# EAGLE design ASD2101 (EAGLE 6.3)
DATABASE: ./../../../../../Components/TinyCircuits_Part_Database.txt
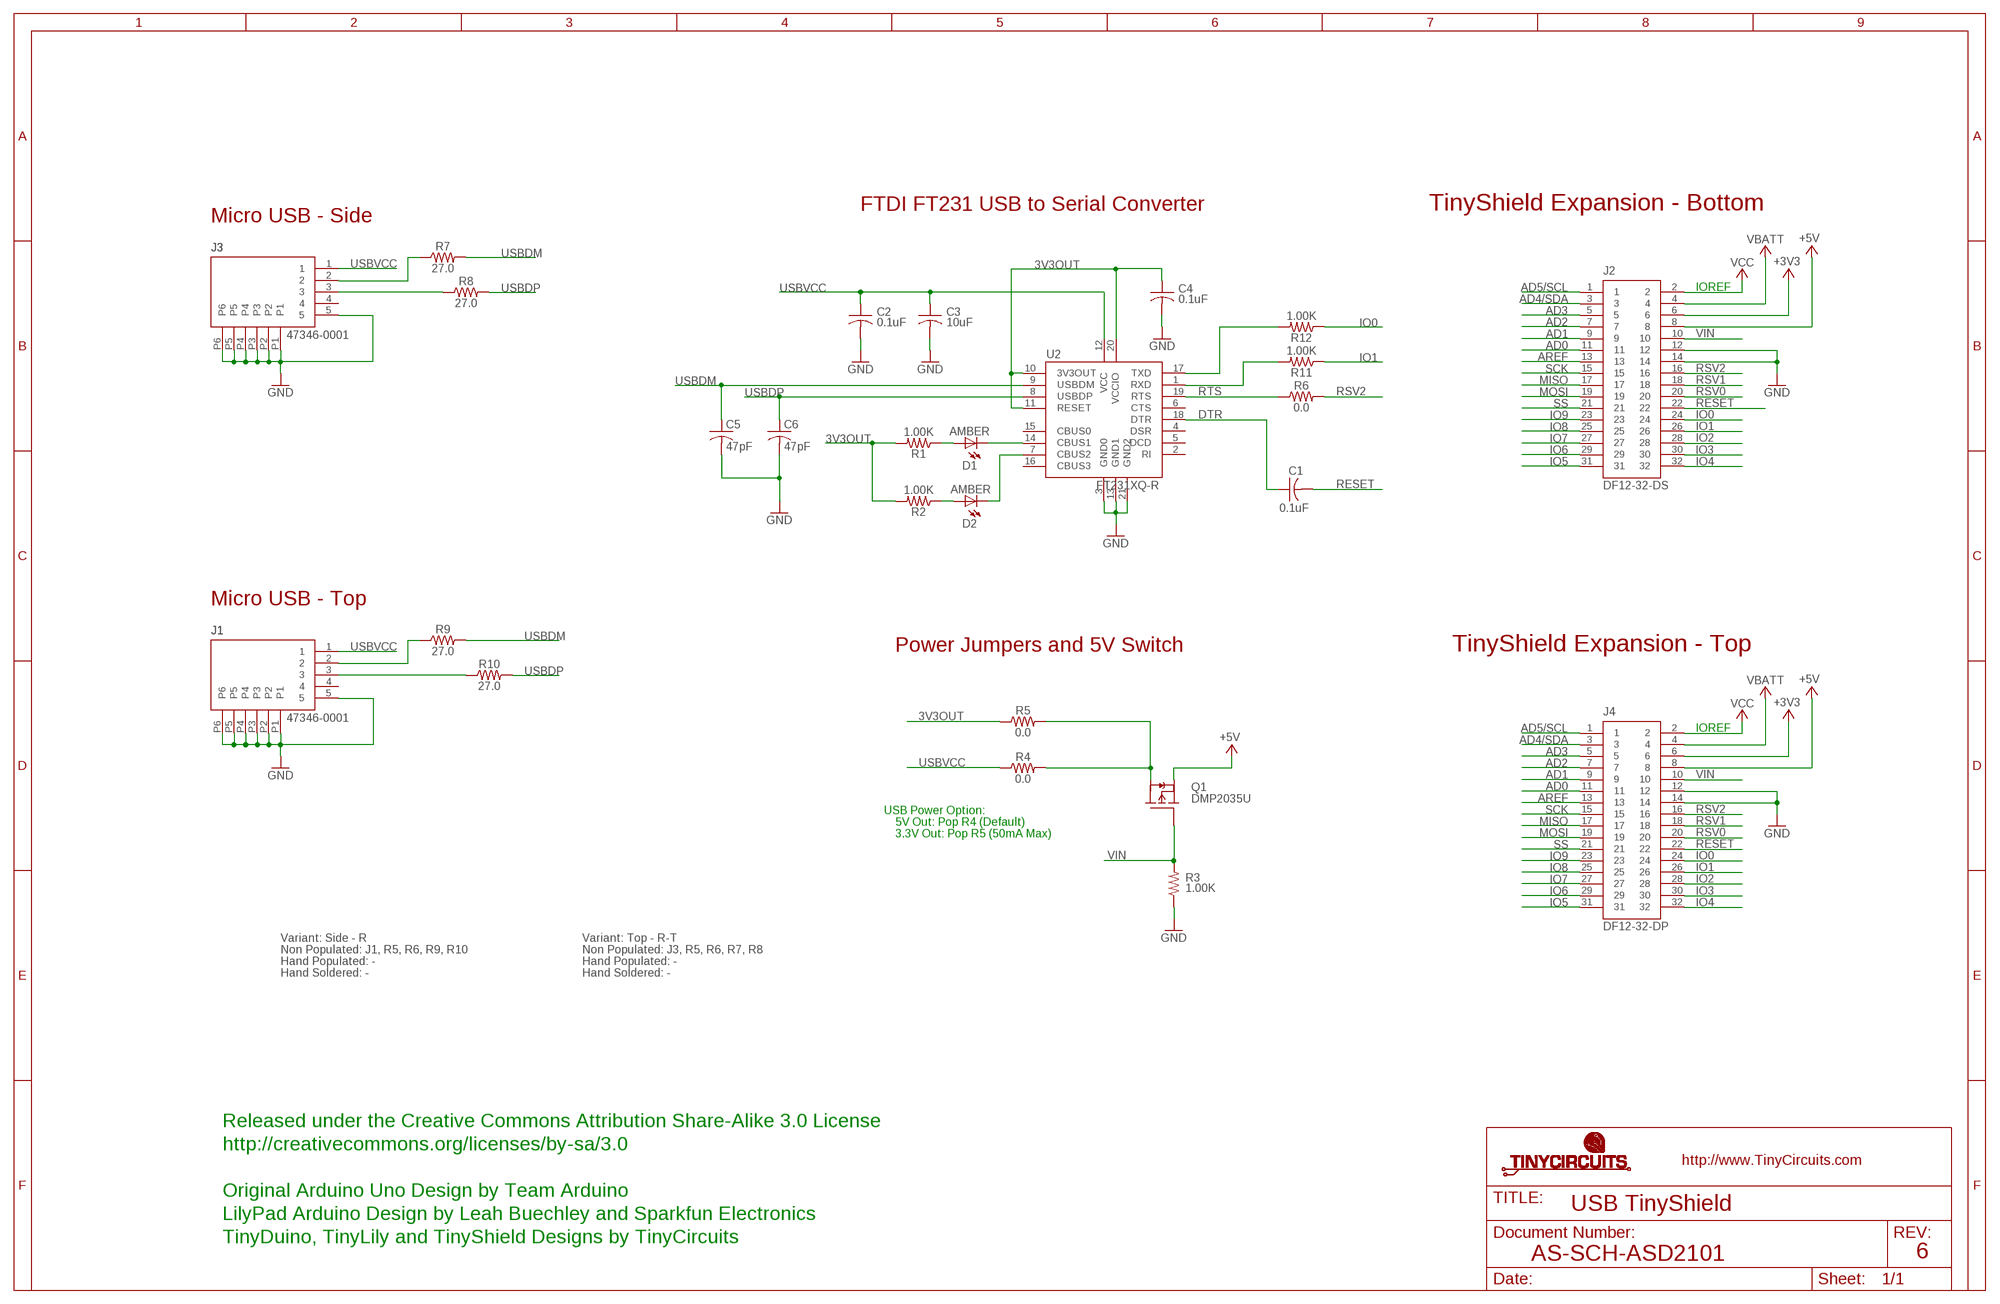
[diagram p0: schematic, sheet 1]

## Parts
C1  0.1uF  AS-ITM-00008  [C0402]
C2  0.1uF  AS-ITM-00008  [C0402]
C3  10uF  AS-ITM-00002  [C0603]
C4  0.1uF  AS-ITM-00008  [C0402]
C5  47pF  AS-ITM-00241  [0402]
C6  47pF  AS-ITM-00241  [0402]
D1  AMBER  AS-ITM-00026  [LNJ_LED]
D2  AMBER  AS-ITM-00026  [LNJ_LED]
J1  47346-0001  AS-ITM-00021  [MICRO_USB]
J2  DF12-32-DS  AS-ITM-00012  [DF12-32-DS]
J3  47346-0001  AS-ITM-00021  [MICRO_USB]
J4  DF12-32-DP  AS-ITM-00015  [DF12-32-DP]
Q1  DMP2035U  AS-ITM-00024  [SOT23]
R1  1.00K  AS-ITM-00003  [0402]
R2  1.00K  AS-ITM-00003  [0402]
R3  1.00K  AS-ITM-00003  [0402]
R4  0.0  AS-ITM-00076  [0402]
R5  0.0  AS-ITM-00076  [0402]
R6  0.0  AS-ITM-000760402_SHORT  [0402_SHORT]
R7  27.0  AS-ITM-00240  [0402]
R8  27.0  AS-ITM-00240  [0402]
R9  27.0  AS-ITM-00240  [0402]
R10  27.0  AS-ITM-00240  [0402]
R11  1.00K  AS-ITM-00003  [0402]
R12  1.00K  AS-ITM-00003  [0402]
U2  FT231XQ-R  AS-ITM-00223  [QFN20]

## Nets
3V3OUT: C4.1 R1.2 R2.2 R5.1 U2.10(3V3OUT) U2.11(RESET) U2.20(VCCIO)
+3V3: J2.6 J4.6
+5V: J2.8 J4.8 Q1.E(S)
AD0: J2.11 J4.11
AD1: J2.9 J4.9
AD2: J2.7 J4.7
AD3: J2.5 J4.5
AD4/SDA: J2.3 J4.3
AD5/SCL: J2.1 J4.1
AREF: J2.13 J4.13
DTR: C1.1 U2.18(DTR)
GND: C2.2 C3.2 C4.2 C5.2 C6.2 J1.5 J1.P1 J1.P2 J1.P3 J1.P4 J1.P5 J1.P6 J2.12 J2.14 J3.5 J3.P1 J3.P2 J3.P3 J3.P4 J3.P5 J3.P6 J4.12 J4.14 R3.1 U2.3(GND0) U2.13(GND1) U2.21(GND2)
IO0: J2.24 J4.24 R12.1
IO1: J2.26 J4.26 R11.1
IO2: J2.28 J4.28
IO3: J2.30 J4.30
IO4: J2.32 J4.32
IO5: J2.31 J4.31
IO6: J2.29 J4.29
IO7: J2.27 J4.27
IO8: J2.25 J4.25
IO9: J2.23 J4.23
MISO: J2.17 J4.17
MOSI: J2.19 J4.19
N$1: J3.2 R7.1
N$2: J1.2 R9.1
N$3: J1.3 R10.1
N$4: Q1.C(D) R4.2 R5.2
N$5: D2.C U2.7(CBUS2)
N$6: D1.A R1.1
N$7: D2.A R2.1
N$8: J3.3 R8.1
N$9: R11.2 U2.1(RXD)
N$10: R12.2 U2.17(TXD)
N$16: D1.C U2.14(CBUS1)
RESET: C1.2 J2.22 J4.22
RSV0: J2.20 J4.20
RSV1: J2.18 J4.18
RSV2: J2.16 J4.16 R6.2
RTS: R6.1 U2.19(RTS)
SCK: J2.15 J4.15
SS: J2.21 J4.21
USBDM: C5.1 R7.2 R9.2 U2.9(USBDM)
USBDP: C6.1 R8.2 R10.2 U2.8(USBDP)
USBVCC: C2.1 C3.1 J1.1 J3.1 R4.1 U2.12(VCC)
VBATT: J2.4 J4.4
VCC: J2.2 J4.2
VIN: J2.10 J4.10 Q1.B(G) R3.2
Unconnected: J1.4 J3.4 U2.2(RI) U2.4(DSR) U2.5(DCD) U2.6(CTS) U2.15(CBUS0) U2.16(CBUS3)

## Notes on the sheet
- FTDI FT231 USB to Serial Converter | TinyShield Expansion - Bottom
- Micro USB - Side
- IOREF
- Micro USB - Top
- Power Jumpers and 5V Switch | TinyShield Expansion - Top
- IOREF
- USB Power Option:
- 5V Out: Pop R4 (Default)
- 3.3V Out: Pop R5 (50mA Max)
- Variant: Side - R | Variant: Top - R-T
- Non Populated: J1, R5, R6, R9, R10 | Non Populated: J3, R5, R6, R7, R8
- Hand Populated: - | Hand Populated: -
- Hand Soldered: - | Hand Soldered: -
- Released under the Creative Commons Attribution Share-Alike 3.0 License
- http://creativecommons.org/licenses/by-sa/3.0
- Original Arduino Uno Design by Team Arduino
- USB TinyShield
- LilyPad Arduino Design by Leah Buechley and Sparkfun Electronics
- TinyDuino, TinyLily and TinyShield Designs by TinyCircuits
- AS-SCH-ASD2101 | 6

## Library data of the parts
C1 C2 C4 = tinycircuits:AS-ITM-00008: CAP CER 0.1UF 16V 10% X5R 0402; PARTNO: AS-ITM-00008
C3 = tinycircuits:AS-ITM-00002: CAP CER 10UF 10V 20% X5R 0603; PARTNO: AS-ITM-00002
C5 C6 = tinycircuits:AS-ITM-00241: CAP CER 47PF 50V 5% NP0 0402; PARTNO: AS-ITM-00241
D1 D2 = tinycircuits:AS-ITM-00026: LED AMBER SIDE VIEW SMD; PARTNO: AS-ITM-00026; PNPROTATION: 90
J1 J3 = tinycircuits:AS-ITM-00021: CONN RCPT 5POS MICRO USB R/A; PARTNO: AS-ITM-00021; PNPROTATION: 90
J2 = tinycircuits:AS-ITM-00012: CONN RECEPT 32POS 3MM SMD 0.5MM; PARTNO: AS-ITM-00012
J4 = tinycircuits:AS-ITM-00015: CONN HEADER 32POS 3MM SMD 0.5MM; PARTNO: AS-ITM-00015
Q1 = tinycircuits:AS-ITM-00024: P-Channel MOSFET SOT-23; PARTNO: AS-ITM-00024; PNPROTATION: 0
R1-R3 R11 R12 = tinycircuits:AS-ITM-00003: RES 1.00K OHM 1/16W 1% 0402; PARTNO: AS-ITM-00003
R4 R5 = tinycircuits:AS-ITM-00076: RES 0.0 OHM 1/16W 1% 0402 SMD; PARTNO: AS-ITM-00076
R6 = tinycircuits:AS-ITM-00076: RES 0.0 OHM 1/16W 1% 0402 SMD; VALUE: SHORT
R7-R10 = tinycircuits:AS-ITM-00240: RES 27 OHM 1/16W 5% 0402 SMD; PARTNO: AS-ITM-00240
U2 = tinycircuits:AS-ITM-00223: IC USB SERIAL FULL UART 20QFN; PARTNO: AS-ITM-00223; PNPROTATION: 270

## Net classes
2 gnd: width 0.305 mm, drill 0.559 mm, clearance 0.254 mm

## Board
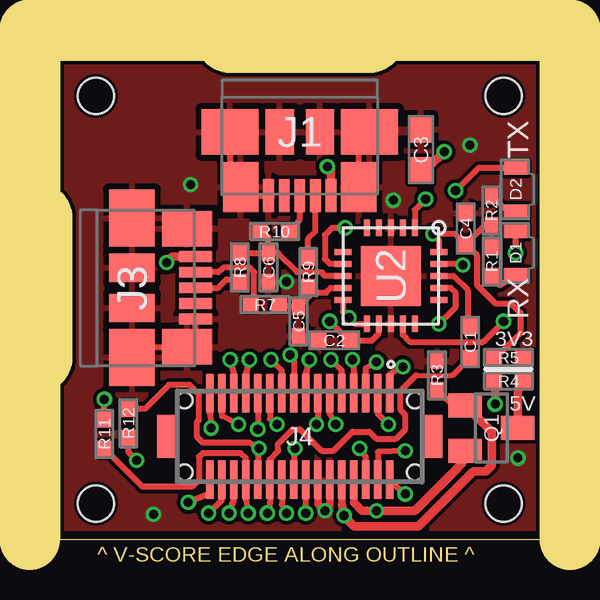
[diagram p1: board, top side]
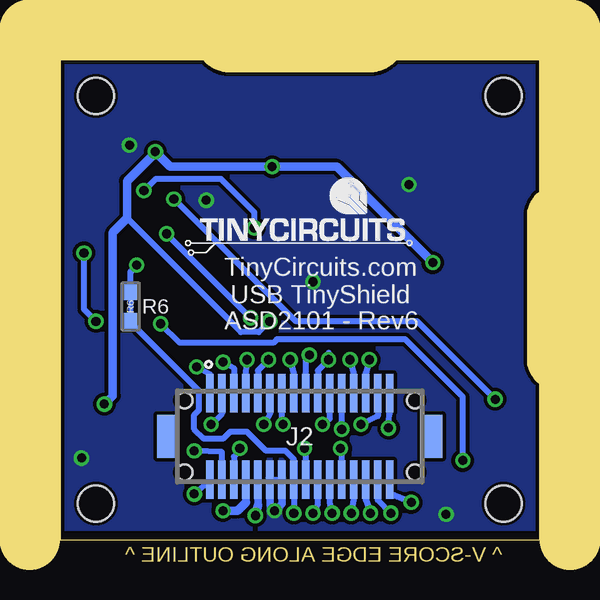
[diagram p2: board, bottom side, seen from below]

Size 20 x 20 mm. Coordinates in mm from the lower left corner, seen from the top.
Outline: 20,20 20,0 0,0 0,6.5 arc45 0.5,7.4 0.5,13.6 arc45 0,14.5 0,20 6,20 arc45 6.9,19.5 13.1,19.5 arc45 14,20 20,20
Copper layers (1*16): Top 0.035mm / dielectric 1.5mm / Bottom 0.035mm
Design rules "default *": minimum track width 8mil, minimum drill 15mil, track to track 6mil, track to pad 6mil, pad to pad 6mil, via to via 6mil, smd to smd 6mil, copper to edge 6mil, drill to drill 8mil, minimum pad ring 8mil, minimum via ring 5mil, stop-mask expansion 4mil, vias tented up to drill 25mil, thermal gap 10mil
Holes 1.5 mm at 1.5,18.5 18.5,18.5 18.5,1.5 1.5,1.5
tRestrict: 1 lines
bRestrict: 1 lines
Milling: 5 lines

### Footprints (pad centres in the part's own frame; a part is rotated, then mirrored left to right if it is on the bottom)
C0402 = smd 0.65 x 0.6: 1 -0.65,0; 2 0.65,0
C0603 = smd 1.1 x 1: 1 -0.85,0; 2 0.85,0
0402 = smd 0.65 x 0.55: 1 -0.6,0; 2 0.6,0
LNJ_LED = smd 1 x 0.55: A 0,0.9; C 0,-0.9
MICRO_USB = smd 1.38 x 0.45: 1 2.66,1.3; 2 2.66,0.65; 3 2.66,0; 4 2.66,-0.65; 5 2.66,-1.3 | smd 2.1 x 1.475: P1 2.3,-2.462; P2 2.3,2.462 | smd 1.9 x 2.375: P3 0,2.913; P4 0,-2.913 | smd 1.9 x 1.175: P5 0,0.838; P6 0,-0.838
DF12-32-DS = smd 0.3 x 1.6: 1 -3.75,1.8; 2 -3.75,-1.8; 3 -3.25,1.8; 4 -3.25,-1.8; 5 -2.75,1.8; 6 -2.75,-1.8; 7 -2.25,1.8; 8 -2.25,-1.8; 9 -1.75,1.8; 10 -1.75,-1.8; 11 -1.25,1.8; 12 -1.25,-1.8; 13 -0.75,1.8; 14 -0.75,-1.8; 15 -0.25,1.8; 16 -0.25,-1.8; 17 0.25,1.8; 18 0.25,-1.8; 19 0.75,1.8; 20 0.75,-1.8; 21 1.25,1.8; 22 1.25,-1.8; 23 1.75,1.8; 24 1.75,-1.8; 25 2.25,1.8; 26 2.25,-1.8; 27 2.75,1.8; 28 2.75,-1.8; 29 3.25,1.8; 30 3.25,-1.8; 31 3.75,1.8; 32 3.75,-1.8 | smd 0.9 x 1.8: F1 -5.5,0; F2 5.5,0 | hole 0.65: -4.8,1.5; 4.8,1.5
DF12-32-DP = smd 0.3 x 1.6: 1 -3.75,-1.8; 2 -3.75,1.8; 3 -3.25,-1.8; 4 -3.25,1.8; 5 -2.75,-1.8; 6 -2.75,1.8; 7 -2.25,-1.8; 8 -2.25,1.8; 9 -1.75,-1.8; 10 -1.75,1.8; 11 -1.25,-1.8; 12 -1.25,1.8; 13 -0.75,-1.8; 14 -0.75,1.8; 15 -0.25,-1.8; 16 -0.25,1.8; 17 0.25,-1.8; 18 0.25,1.8; 19 0.75,-1.8; 20 0.75,1.8; 21 1.25,-1.8; 22 1.25,1.8; 23 1.75,-1.8; 24 1.75,1.8; 25 2.25,-1.8; 26 2.25,1.8; 27 2.75,-1.8; 28 2.75,1.8; 29 3.25,-1.8; 30 3.25,1.8; 31 3.75,-1.8; 32 3.75,1.8 | smd 0.9 x 1.8: F1 -5.5,0; F2 5.5,0 | hole 0.65: -4.8,1.5; 4.8,1.5
SOT23 = smd 1 x 1.4: B -0.95,-1.1; C 0,1.1; E 0.95,-1.1
0402_SHORT = smd 0.65 x 0.55: 1 -0.6,0; 2 0.6,0
QFN20 = smd 0.7 x 0.25: 1 -2,1; 2 -2,0.5; 3 -2,0; 4 -2,-0.5; 5 -2,-1; 11 2,-1; 12 2,-0.5; 13 2,0; 14 2,0.5; 15 2,1 | smd 0.25 x 0.7: 6 -1,-2; 7 -0.5,-2; 8 0,-2; 9 0.5,-2; 10 1,-2; 16 1,2; 17 0.5,2; 18 0,2; 19 -0.5,2; 20 -1,2 | smd 2.5 x 2.5: 21 0,0

### Placement (x,y rotation side)
C1  17.1,8.24 270 top
C2  11.44,8.31 180 top
C3  15.05,16.26 90 top
C4  16.92,12.97 90 top
C5  9.95,9.1 270 top
C6  8.7,11.35 270 top
D1  19,11.95 180 top
D2  19,14.6 180 top
J1  10,17 270 top
J2  10,4.3 0 bottom
J3  3,10.5 0 top
J4  10,4.3 180 top
Q1  17.99,4.65 270 top
R1  18,11.6 90 top
R2  17.99,13.72 270 top
R3  15.72,6.85 270 top
R4  18.7,6.61 0 top
R5  18.7,7.59 0 top
R6  17.06,9.71 270 bottom
R7  8.55,9.8 0 top
R8  7.5,11.35 90 top
R9  10.35,11.15 270 top
R10  8.95,12.85 180 top
R11  1.85,4.4 90 top
R12  2.85,4.85 270 top
U2  13.8,11 270 top
U$1  [DOCFIELD-TINYCIRCUITS-PCB]  33.97,-10.03 0 top  (outside the outline)

### Tracks (layer width: path | path; a pad name or v marks a point on that pad's centre or on a via)
3V3OUT  (via drill 0.38)
  Top 0.254: U2.11 12.3,9 v12.05,9.25 11.8,9.5 U2.10 | U2.20 15.8,12.5 v15.55,12.75 16.49,12.75 C4.1 | R2.2 17.72,13.12 C4.1 | 18.01,13 R2.2 | R5.1 18.14,7.55 19.2,8.6 19.2,9.45 18.8,9.85 18.15,9.85 17.4,10.6 17.4,11.84 C4.1 | R1.2 18,13.11 R2.2
  Bottom 0.254: v12.05,9.25 v15.55,12.75
+3V3  (via drill 0.38)
  Top 0.254: J2.6 12.75,3.45 v12.5,3.8
  Bottom 0.254: v12.5,3.8 12.75,3.45 J2.6
+5V  (via drill 0.38)
  Top 0.254: Q1.E 16.79,3.2
  Top 0.305: 12.25,1.55 J2.8
  Top 0.356: 12.25,1.55 12.6,1.2 v13.2,1.2 14.8,1.2 16.4,2.8 16.79,3.2
  Bottom 0.305: J2.8 12.25,1.55
  Bottom 0.356: 12.25,1.55 12.6,1.2 v13.2,1.2
AD0  (via drill 0.38)
  Top 0.254: v11.5,4.8 11.25,5.25 J2.11
  Bottom 0.254: J2.11 11.25,5.25 v11.5,4.8
AD1  (via drill 0.38)
  Top 0.254: J2.9 11.75,7.05 v11.3,7.5
  Bottom 0.254: v11.3,7.5 11.75,7.05 J2.9
AD2  (via drill 0.38)
  Top 0.254: v12.2,7.5 12.25,6.95 J2.7
  Bottom 0.254: J2.7 12.25,6.95 v12.2,7.5
AD3  (via drill 0.38)
  Top 0.254: J2.5 12.75,7.15 v13.2,7.4
  Bottom 0.254: v13.2,7.4 12.75,7.15 J2.5
AD4/SDA  (via drill 0.38)
  Top 0.254: v13.7,4.8 13.25,5.25 J2.3
  Bottom 0.254: J2.3 13.25,5.25 v13.7,4.8
AD5/SCL  (via drill 0.38)
  Top 0.254: J2.1 13.75,6.9 v14.3,7.2
  Bottom 0.254: v14.3,7.2 13.75,6.9 J2.1
AREF  (via drill 0.38)
  Top 0.254: J2.13 10.75,5.15 v10.7,4.8
  Bottom 0.254: v10.7,4.8 10.75,5.15 J2.13
DTR
  Top 0.254: U2.18 16.4,11 17,10.4 17,8.94 C1.1
GND  (via drill 0.38)
  Top 0.254: J3.P4 3.45,8.04 J3.P1 5.66,8.3 J3.5 | C2.2 10.14,8.31 C5.2 | J1.P4 7.09,15.15 J1.P1 7.9,14.34 J1.5 | J1.P2 12.46,16.55 J1.P3
  Top 0.305: J4.14 10.75,1.5 v11.05,1.2 | J4.12 11.25,1.45
  Bottom 0.254: J4.14 J4.12 11.25,2.4
  Bottom 0.305: v11.05,1.2 10.75,1.5 J4.14 | 11.25,1.45 11.25,2.4
  other vias: 19.1,3.4 17.1,16.45 9.45,10.75 13.9,14.15 3.9,1.05 5.45,14.8
  pour Top: 0,20 20,20 20,0 0,0
  pour Bottom: 0,20 20,20 20,0 0,0
IO0  (via drill 0.38)
  Top 0.254: J2.24 8.25,3.65 v8.3,3.8 7.9,4.05 5.95,4.05 5.7,4.3 5.7,4.9 5.8,5 5.8,6.05 5.4,6.45 4.55,6.45 3.55,5.45 R12.1
  Bottom 0.254: J2.24 8.25,3.65 v8.3,3.8
IO1  (via drill 0.38)
  Top 0.254: v7.85,1.1 7.75,1.65 J2.26 7.75,3.4 7.55,3.6 5.95,3.6 5.8,3.45 5.8,2.5 5.5,2.2 3.45,2.2 R11.1
  Bottom 0.254: v7.85,1.1 7.75,1.65 J2.26
IO2  (via drill 0.38)
  Top 0.254: v7.05,1.1 7.25,1.65 J2.28
  Bottom 0.254: J2.28 7.25,1.65 v7.05,1.1
IO3  (via drill 0.38)
  Top 0.254: v6.2,1.1 6.75,1.65 J2.30
  Bottom 0.254: J2.30 6.75,1.65 v6.2,1.1
IO4  (via drill 0.38)
  Top 0.254: J2.32 6.25,1.9 v5.35,1.55
  Bottom 0.254: v5.35,1.55 6.25,1.9 J2.32
IO5  (via drill 0.38)
  Top 0.254: J2.31 6.25,5.25 v6.3,4.65
  Bottom 0.254: v6.3,4.65 6.25,5.25 J2.31
IO6  (via drill 0.38)
  Top 0.254: v7.45,4.8 6.75,5.15 J2.29
  Bottom 0.254: J2.29 6.75,5.15 v7.45,4.8
IO7  (via drill 0.38)
  Top 0.254: J2.27 7.25,6.95 v7.1,7.5
  Bottom 0.254: v7.1,7.5 7.25,6.95 J2.27
IO8  (via drill 0.38)
  Top 0.254: v7.9,7.5 7.75,6.95 J2.25
  Bottom 0.254: J2.25 7.75,6.95 v7.9,7.5
IO9  (via drill 0.38)
  Top 0.254: J2.23 v8.25,4.6
  Bottom 0.254: v8.25,4.6 J2.23
MISO  (via drill 0.38)
  Top 0.254: v9.6,7.7 9.75,7.45 J2.17
  Bottom 0.254: J2.17 9.75,7.45 v9.6,7.7
MOSI  (via drill 0.38)
  Top 0.254: J2.19 9.25,7.05 v8.8,7.5
  Bottom 0.254: J2.19 9.25,7.05 v8.8,7.5 8.8,7.8
N$1
  Top 0.229: 7.9,11.35 7.1,11.35
  Top 0.254: J3.2 6.6,11.15 6.85,11.35 7.1,11.35 | R7.1 8.1,10 8.1,11.15 7.9,11.35
N$2
  Top 0.254: R9.1 10.35,12.55 10.65,12.85 J1.2
N$3
  Top 0.254: R10.1 10,13.35 J1.3
N$4
  Top 0.254: R4.2 19.32,6.68 R5.2
  Top 0.356: Q1.C 19.1,6.13 R4.2
N$5  (via drill 0.38)
  Top 0.254: U2.7 11.25,11.5 11.05,11.7 11.05,12.7 11.35,13 v11.9,13 | D2.C 17.45,15.5 v16.5,14.55
  Bottom 0.254: v16.5,14.55 16,15.05 13.3,15.05 11.9,13.65 v11.9,13
N$6
  Top 0.254: R1.1 18.35,10.6 D1.A
N$7
  Top 0.254: R2.1 18.63,13.72 D2.A
N$8
  Top 0.254: J3.3 6.6,10.5 6.95,10.85 7.45,10.85 R8.1
N$9  (via drill 0.38)
  Top 0.254: R11.2 v1.85,5.85 | v15.25,14.2 14.8,13.75 U2.1
  Bottom 0.254: v1.85,5.85 5.1,9.1 10.15,9.1 v15.25,14.2
N$10  (via drill 0.38)
  Top 0.254: R12.2 2.85,3.65 v3.2,3.3 | v15.8,9 16.5,9.7 16.5,10.3 16.3,10.5 U2.17
  Bottom 0.254: v3.2,3.3 3.2,5.95 5.6,8.35 10.95,8.35 11.1,8.2 15,8.2 v15.8,9
N$16  (via drill 0.38)
  Top 0.254: U2.14 14.3,8.55 14.6,8.25 17.65,8.25 v18.5,9.1 | v19,11.95 D1.C
  Bottom 0.254: v18.5,9.1 19,9.6 v19,11.95
RESET  (via drill 0.38)
  Top 0.203: 14.85,6.85 16.36,6.85
  Top 0.254: v8.65,1.1 8.75,1.55 J2.22 8.75,3.35 9.1,3.7 9.1,4 9.7,4.6 10,4.6 10.9,3.7 11.4,3.7 12.2,4.5 12.9,4.5 13.2,4.2 14,4.2 14.4,4.6 14.4,5.2 14.2,5.4 14.2,6.2 14.85,6.85 | 16.36,6.85 C1.2
  Bottom 0.254: v8.65,1.1 8.75,1.55 J2.22
RSV0  (via drill 0.38)
  Top 0.254: J2.20 9.25,1.45 v9.45,1.1
  Bottom 0.254: v9.45,1.1 9.25,1.45 J2.20
RSV1  (via drill 0.38)
  Top 0.254: v9.8,3.8 9.75,3.75 J2.18
  Bottom 0.254: J2.18 9.75,3.75 v9.8,3.8
RSV2  (via drill 0.38)
  Top 0.254: v10.25,1.1 J2.16
  Bottom 0.254: v10.25,1.1 J2.16 10.25,3.35 10.6,3.7 11.4,3.7 12.2,4.5 12.9,4.5 13.2,4.2 14,4.2 14.4,4.6 14.4,5.2 14.2,5.4 14.2,6.2 14.6,6.6 | 14.6,6.6 14.59,6.6 | 14.6,6.6 17.06,9.06 R6.2
RTS  (via drill 0.38)
  Top 0.254: v16.8,11.45 16.75,11.5 U2.19
  Bottom 0.254: R6.1 17.06,11.16 v16.8,11.45
SCK  (via drill 0.38)
  Top 0.254: v10.4,7.5 10.25,6.95 J2.15
  Bottom 0.254: J2.15 10.25,6.95 v10.4,7.5
SS  (via drill 0.38)
  Top 0.254: J2.21 8.75,5.05 v9.05,4.8
  Bottom 0.254: v9.05,4.8 8.75,5.05 J2.21
USBDM
  Top 0.254: 10.55,10.3 C5.1 9.05,9.75 R7.2 | 10.55,10.3 R9.2 | 10.55,10.3 11.1,10.3 11.3,10.5 U2.9
USBDP
  Top 0.229: 10.9,11.15 9.9,11.15
  Top 0.254: R8.2 C6.1 | C6.1 8.7,12.6 R10.2 | U2.8 11.05,11 10.9,11.15 | 9.9,11.15 9.1,11.95 C6.1
USBVCC  (via drill 0.38)
  Top 0.254: U2.12 13.3,8.6 13,8.3 C2.1 12.09,8.29 12.07,8.27 | R4.1 18.15,6.63 | C3.1 15.39,15.56 | 12.15,8.2 12.07,8.27 | 12.07,8.27 v11.25,9.1
  Top 0.356: J1.1 11.3,15.4 v11.15,15.55 | J3.1 4.7,11.8 v4.45,11.55 | 18.15,6.63 v18.15,5.65 | 15.39,15.56 v16.02,16.18
  Bottom 0.254: 17.2,13.4 12.45,8.65 11.7,8.65 v11.25,9.1 | v16.02,16.18 16.02,16.12
  Bottom 0.356: v4.45,11.55 8.45,15.55 v11.15,15.55 15.4,15.55 v16.02,16.18 | v18.15,5.65 17.8,6 17.8,12.8 17.2,13.4 17.2,14.95 16.02,16.12
VBATT  (via drill 0.38)
  Top 0.254: v14.4,3.7 13.25,3.65 J4.4
  Bottom 0.254: J4.4 13.25,3.65 v14.4,3.7
VCC  (via drill 0.38)
  Top 0.254: v14.4,1.9 14.35,1.9 J2.2
  Bottom 0.254: v14.4,1.9 14.35,1.9 J2.2
VIN  (via drill 0.38)
  Top 0.254: 17,5.5 Q1.B 16.47,5.5 R3.2
  Top 0.305: 11.75,1.45 J2.10
  Top 0.356: 11.75,1.45 v11.85,1 12.25,0.55 14.95,0.55 17.25,2.85 17.75,2.85 18,3.1 18,4.5 17,5.5
  Bottom 0.305: J2.10 11.75,1.45
  Bottom 0.356: 11.75,1.45 v11.85,1

### Text on the board
Dimension: ^ V-SCORE EDGE ALONG OUTLINE ^
tPlace: TX | RX | 3V3 | 5V
bPlace: TinyCircuits.com | USB TinyShield | ASD2101 - Rev6 | R6
Document: FABRICATION DRAWING | NOTES: | 1. PRINTED CIRCUIT BOARD MADE FROM NEMA GRADE FR-4 EPOXY LAMINATE | WITH 1 OUNCE COPPER PLATING AND .024 THICKNESS. | 2. ALL DIMENSIONS ARE GIVEN IN INCHES. | 3. CIRCUIT PATHS ARE FOR REFERENCE ONLY. | 4. HOLE SIZES SHOWN ARE FINISHED DIAMETERS AFTER PLATING. | 5. BOARD PLATED USING REFLOW OR SIMILAR METHOD. | 6. BOARD TO HAVE BLUE SOLDER MASK ON PLATED SURFACES USING WET FILM | 7. SILKSCREEN BOARD USING WHITE INK. | SR100 OR SR1010 EPOXY. EQUIVALENT WET OR DRY FILM MAY BE USED. | 8. THE FOLLOWING INFORMATION APPLIES TO THIS BOARD: | * 2 COPPER LAYERS | * .024 BOARD THICKNESS | * REQUIRES TOP SIDE SILKSCREEN | Released under the Creative Commons Attribution Share-Alike 3.0 License | http://creativecommons.org/licenses/by-sa/3.0 | Original Arduino Uno Design by Team Arduino | LilyPad Arduino Design by Leah Buechley and Sparkfun Electronics | TinyDuino, TinyLily and TinyShield Designs by TinyCircuits | USB TinyShield | AS-PCB-ASD2101 | 6